# EAGLE design power board - LiPo (EAGLE 5.07)
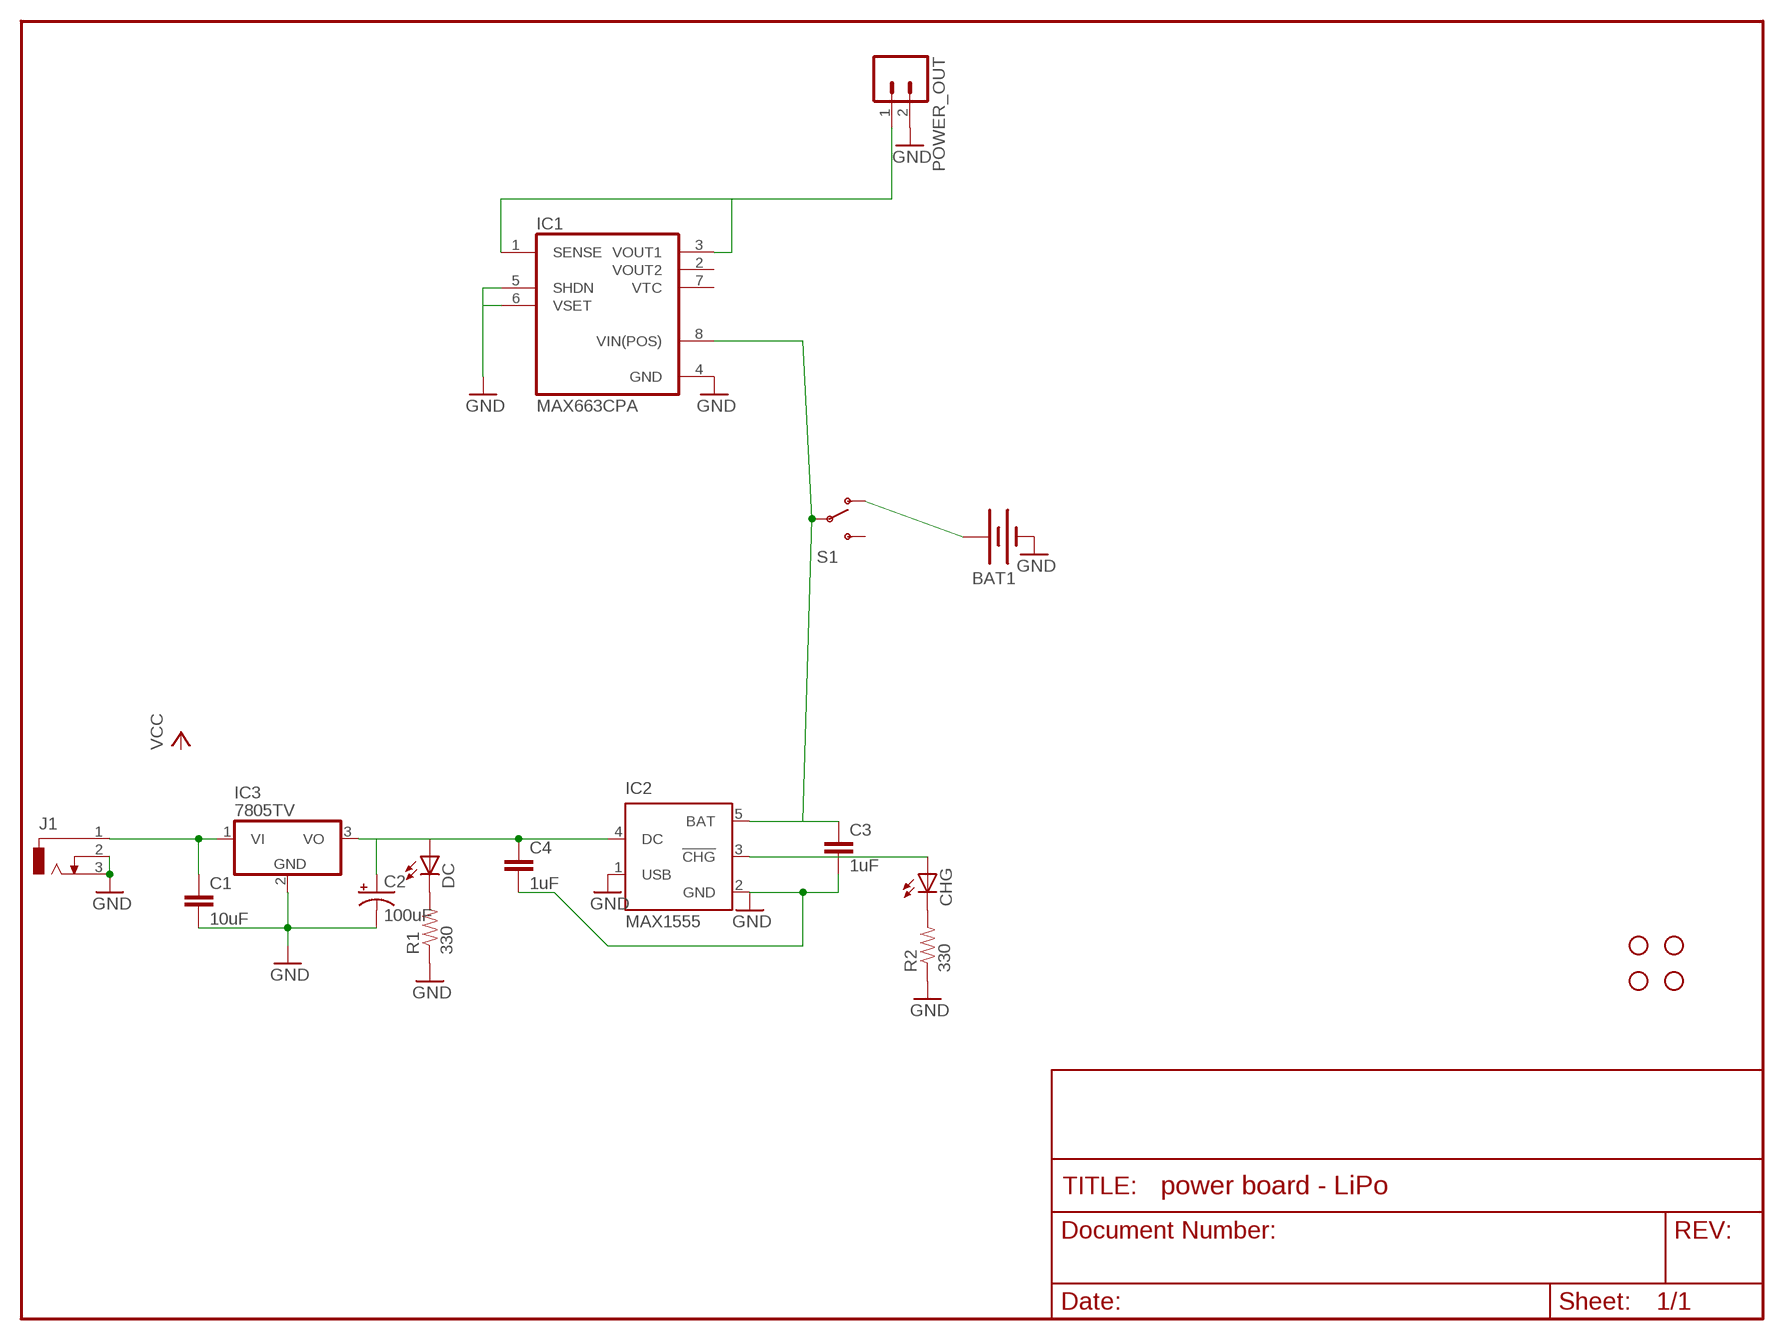
[diagram p0: schematic, sheet 1]

## Parts
BAT1  BATTERY1100  [LIPO-1100MAH]
C1  10uF  CAPPTH1  [CAP-PTH-5MM]
C2  100uF  CAP_POLPTH1  [CPOL-RADIAL-100UF-25V]
C3  1uF  CAPPTH1  [CAP-PTH-5MM]
C4  1uF  CAPPTH1  [CAP-PTH-5MM]
CHG  LED3MM  [LED3MM]
DC  LED3MM  [LED3MM]
IC1  MAX663CPA  [DIL08]
IC2  MAX1555  [SOT23-5L]
IC3  7805TV  [TO220V]
J1  DCJ0303  [DCJ0303]
JP1  STAND-OFFTIGHT  [STAND-OFF-TIGHT]
JP2  STAND-OFFTIGHT  [STAND-OFF-TIGHT]
JP3  STAND-OFFTIGHT  [STAND-OFF-TIGHT]
JP4  STAND-OFFTIGHT  [STAND-OFF-TIGHT]
POWER_OUT  M02LOCK  [1X02_LOCK]
R1  330  RESISTORPTH1  [AXIAL-0.3]
R2  330  RESISTORPTH1  [AXIAL-0.3]
S1  SWITCH-SPSTPTH_LOCK  [SWITCH-SPDT_LOCK.007S]

## Nets
GND: BAT1.- C1.2 C2.2(-) C3.2 C4.2 IC1.4(GND) IC1.5(SHDN) IC1.6(VSET) IC2.1(USB) IC2.2(GND) IC3.2(GND) J1.2 J1.3 POWER_OUT.2 R1.P$1 R2.P$1
N$1: BAT1.+ S1.1(O)
N$2: C1.1 IC3.1(VI) J1.1
N$3: IC1.1(SENSE) IC1.3(VOUT1) POWER_OUT.1
N$4: C2.1(+) C4.1 DC.A IC2.4(DC) IC3.3(VO)
N$5: C3.1 IC1.8(VIN(POS)) IC2.5(BAT) S1.2(P)
N$6: DC.K(C) R1.P$2
N$7: CHG.K(C) R2.P$2
N$8: CHG.A IC2.3(!CHG)
Unconnected: IC1.2(VOUT2) IC1.7(VTC) S1.3(S)

## Library data of the parts
BAT1 = SparkFun:BATTERY: Battery Holders Various common sizes : AA, AAA, 20mm coin cell and 12mm coin cell.
C1 C3 C4 = SparkFun:CAP: Capacitor Standard 0603 ceramic capacitor, and 0.1" leaded capacitor.
C2 = SparkFun:CAP_POL: Capacitor Polarized These are standard SMD and PTH capacitors. Normally 10uF, 47uF, and 100uF in electrolytic and tantalum varieties. Always verify the external diameter of the through hole cap, it varies with capacity, voltage, and manufacturer. The EIA devices should be standard.
CHG DC = led:LED: LED OSRAM: - CHIPLED LG R971, LG N971, LY N971, LG Q971, LY Q971, LO R971, LY R971 LH N974, LH R974 LS Q976, LO Q976, LY Q976 LO Q996 - Hyper CHIPLED LW Q18S LB Q993, LB Q99A, LB R99A - SideLED LS A670, LO A670, LY A670, LG A670, LP A670 LB A673, LV A673, LT A673, LW A673 LH A674 LY A675 LS A676, LA A676, LO A676, LY A676, LW A676 LS A679, LY A679, LG A679 - Hyper Micro SIDELED® LS Y876, LA Y876, LO Y876, LY Y876 LT Y87S - SmartLED LW L88C, LW L88S LB L89C, LB L89S, LG L890 LS L89K, LO L89K, LY L89K LS L896, LA L896, LO L896, LY L896 - TOPLED LS T670, LO T670, LY T670, LG T670, LP T670 LSG T670, LSP T670, LSY T670, LOP T670, LYG T670 LG T671, LOG T671, LSG T671 LB T673, LV T673, LT T673, LW T673 LH T674 LS T676, LA T676, LO T676, LY T676, LB T676, LH T676, LSB T676, LW T676 LB T67C, LV T67C, LT T67C, LS T67K, LO T67K, LY T67K, LW E67C LS E67B, LA E67B, LO E67B, LY E67B, LB E67C, LV E67C, LT E67C LW T67C LS T679, LY T679, LG T679 LS T770, LO T770, LY T770, LG T770, LP T770 LB T773, LV T773, LT T773, LW T773 LH T774 LS E675, LA E675, LY E675, LS T675 LS T776, LA T776, LO T776, LY T776, LB T776 LHGB T686 LT T68C, LB T68C - Hyper Mini TOPLED® LB M676 - Mini TOPLED Santana® LG M470 LS M47K, LO M47K, LY M47K Source: http://www.osram.convergy.de LUXEON: - LUMILED® LXK2-PW12-R00, LXK2-PW12-S00, LXK2-PW14-U00, LXK2-PW14-V00 LXK2-PM12-R00, LXK2-PM12-S00, LXK2-PM14-U00 LXK2-PE12-Q00, LXK2-PE12-R00, LXK2-PE12-S00, LXK2-PE14-T00, LXK2-PE14-U00 LXK2-PB12-K00, LXK2-PB12-L00, LXK2-PB12-M00, LXK2-PB14-N00, LXK2-PB14-P00, LXK2-PB14-Q00 LXK2-PR12-L00, LXK2-PR12-M00, LXK2-PR14-Q00, LXK2-PR14-R00 LXK2-PD12-Q00, LXK2-PD12-R00, LXK2-PD12-S00 LXK2-PH12-R00, LXK2-PH12-S00 LXK2-PL12-P00, LXK2-PL12-Q00, LXK2-PL12-R00 Source: www.luxeon.com KINGBRIGHT: KA-3528ASYC Source: www.kingbright.com
IC1 = maxim:MAX663CPA: Positive VOLTAGE REGULATOR
IC2 = maxim:MAX1555: Dual-Input USB/AC Adapter 1-Cell Li+ Battery Chargers Source: http://www.maxim-ic.com .. MAX1551-MAX1555.pdf
IC3 = linear:78*: Positive VOLTAGE REGULATOR Source: http://cache.national.com/ds/LM/LM78L05.pdf http://www.fairchildsemi.com/ds/LM/LM7805.pdf
J1 = con-jack:DCJ0303: DC POWER JACK Source: DCJ0303.pdf
JP1-JP4 = SparkFun:STAND-OFF: Stand Off This is the mechanical footprint for a #4 phillips button head screw. Use the keepout ring to avoid running the screw head into surrounding components. SKU : PRT-00447
POWER_OUT = SparkFun:M02: Header 2 Standard 2-pin 0.1" header. Use with straight break away headers (SKU : PRT-00116), right angle break away headers (PRT-00553), swiss pins (PRT-00743), machine pins (PRT-00117), and female headers (PRT-00115). Molex polarized connector foot print use with SKU : PRT-08233 with associated crimp pins and housings.
R1 R2 = SparkFun:RESISTOR: Resistor Basic schematic elements and footprints for 0603, 1206, and PTH 1/10th watt (small) resistors.
S1 = SparkFun:SWITCH-SPST: SPST Switch Simple slide switch. Spark Fun Electronics SKU : COM-00102

## Board
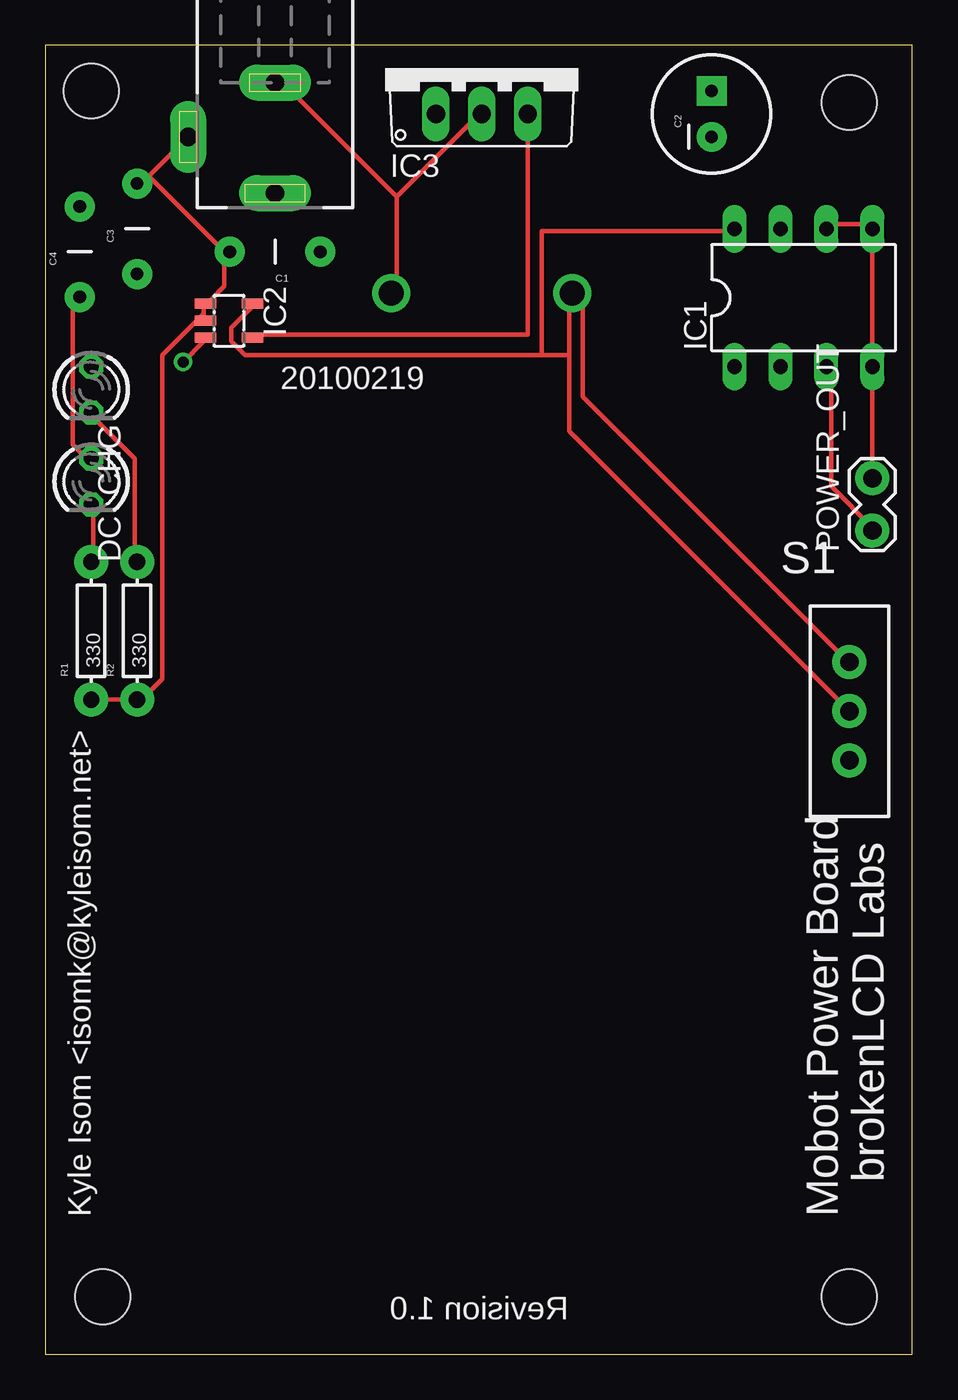
[diagram p1: board, top side]
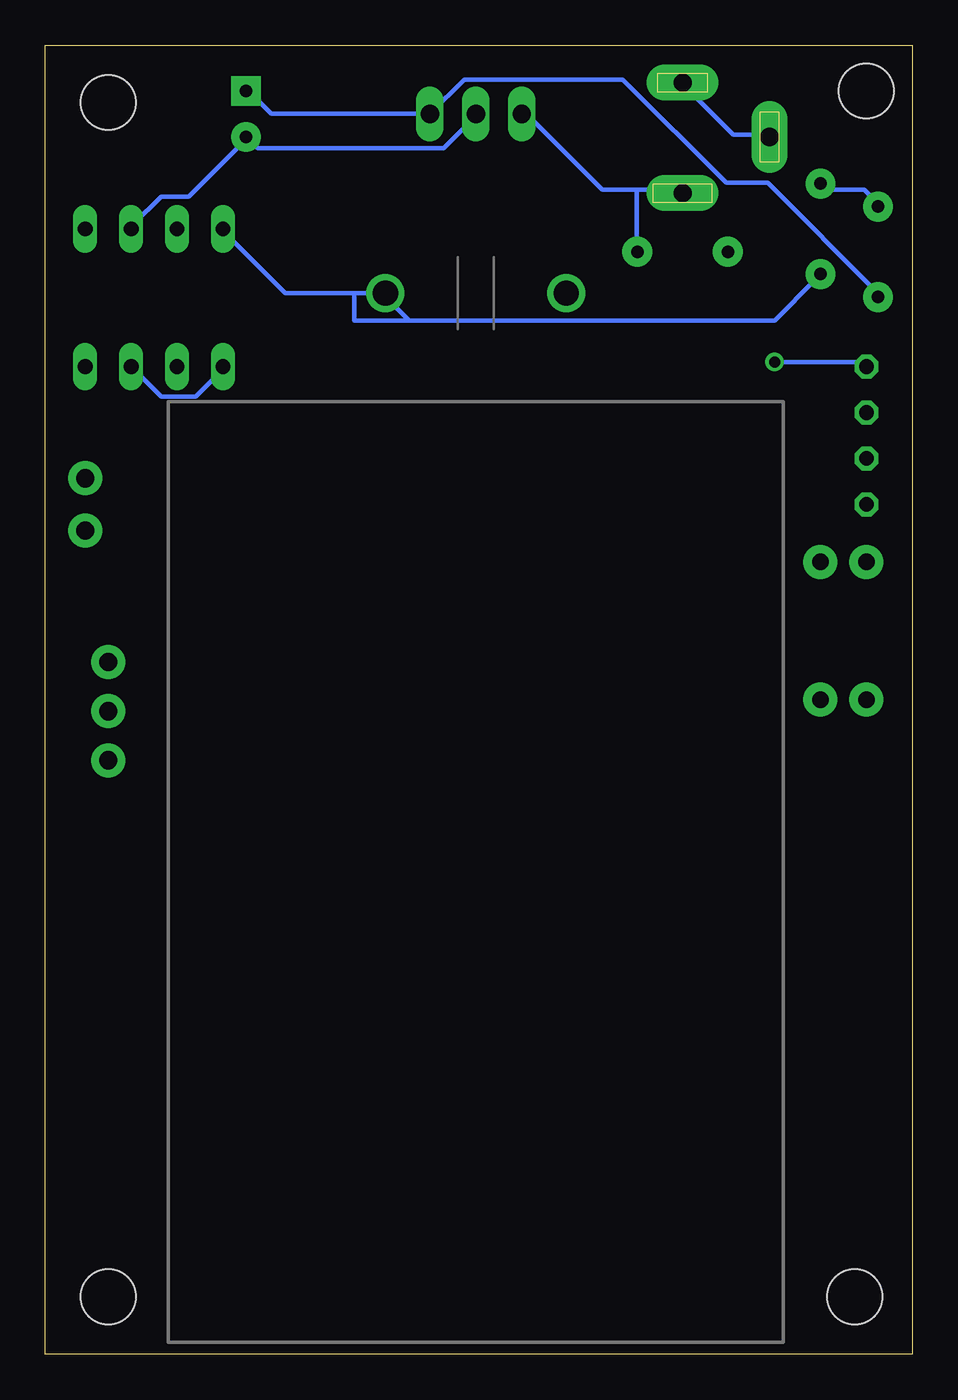
[diagram p2: board, bottom side, seen from below]

Size 47.93 x 72.38 mm. Coordinates in mm from the lower left corner, seen from the top.
Outline: 0,0 47.93,0 47.93,72.38 0,72.38 0,0
Copper layers (1*16): Top 0.035mm / dielectric 1.5mm / Bottom 0.035mm
Design rules "default": minimum track width 10mil, minimum drill 24mil, track to track 8mil, track to pad 8mil, pad to pad 8mil, via to via 8mil, smd to smd 8mil, copper to edge 40mil, drill to drill 8mil, minimum pad ring 10mil, minimum via ring 8mil, stop-mask expansion 4mil, vias tented up to drill 0mil, thermal gap 10mil

### Footprints (pad centres in the part's own frame; a part is rotated, then mirrored left to right if it is on the bottom)
LIPO-1100MAH = drill 1.397 round: + -5,32; - 5,32
CAP-PTH-5MM = drill 0.7 pad 1.651 round: 1 -2.5,0; 2 2.5,0
CPOL-RADIAL-100UF-25V = drill 0.7 pad 1.651 square: 1 1.27,0 | drill 0.7 pad 1.651 round: 2 -1.27,0
LED3MM = drill 0.813 octagon: A -1.27,0; K 1.27,0
DIL08 = drill 0.813 long: 1 -3.81,-3.81; 2 -1.27,-3.81; 3 1.27,-3.81; 4 3.81,-3.81; 5 3.81,3.81; 6 1.27,3.81; 7 -1.27,3.81; 8 -3.81,3.81
SOT23-5L = smd 0.55 x 1.2: 1 -0.95,-1.3; 2 0,-1.3; 3 0.95,-1.3; 4 0.95,1.3; 5 -0.95,1.3
TO220V = drill 1.016 long: 1 -2.54,-2.54; 2 0,-2.54; 3 2.54,-2.54
DCJ0303 = drill 1 pad 2 long: 1 0,3.1; 2 4.8,0; 3 0,-3
STAND-OFF-TIGHT = hole 3.048: 0,0
1X02_LOCK = drill 1.016 pad 1.88 round: 1 -0.178,0; 2 2.718,0
AXIAL-0.3 = drill 0.9 pad 1.88 round: P$1 -3.81,0; P$2 3.81,0
SWITCH-SPDT_LOCK.007S = drill 1.016 pad 1.88 round: 1 0,2.718; 2 0,0; 3 0,-2.718

### Placement (x,y rotation side)
BAT1  24.13,26.67 0 bottom
C1  12.7,60.96 180 top
C2  36.83,68.58 90 top
C3  5.08,62.23 90 top
C4  1.91,60.96 90 top
CHG  2.54,53.34 270 top
DC  2.54,48.26 270 top
IC1  41.91,58.42 0 top
IC2  10.16,57.15 270 top
IC3  24.13,71.12 0 top
J1  12.7,67.31 180 top
JP1  2.54,69.85 0 top
JP2  3.17,3.17 0 top
JP3  44.45,69.22 0 top
JP4  44.45,3.17 0 top
POWER_OUT  45.72,45.72 90 top
R1  2.54,40.01 90 top
R2  5.08,40.01 90 top
S1  44.45,35.56 0 top

### Tracks (layer width: path | path; a pad name or v marks a point on that pad's centre or on a via)
GND
  Top 0.254: POWER_OUT.2 IC1.4 IC1.5 45.72,62.48 43.43,62.48 IC1.6 | 19.43,64.01 24,68.58 IC3.2 | 19.43,64.01 19.43,58.67 BAT1.- | R1.P$1 R2.P$1 5.33,36.2 6.48,37.34 6.48,55.24 8.76,57.53 | 8.76,57.53 8.76,57.91 IC2.1 9.14,58.29 9.91,59.05 9.91,60.96 | 8.76,57.53 8.76,57.15 IC2.2 | 5.71,65.15 5.33,64.77 C3.2 5.71,65.15 | 5.71,65.15 7.62,67.06 J1.2 | 9.91,60.96 5.71,65.15 | 9.91,60.96 C1.2 | 19.43,64.01 12.95,70.48 J1.3
  Bottom 0.254: IC1.6 43.05,62.48 41.53,64.01 40.01,64.01 36.96,67.06 C2.2 36.2,66.67 25.91,66.67 24,68.58 IC3.2 | C4.2 1.91,63.63 2.67,64.39 4.95,64.39 C3.2 | J1.3 12.57,70.1 9.91,67.44 8,67.44 J1.2
N$1
  Top 0.254: S1.1 44.2,38.48 29.72,52.96 29.72,58.29 29.34,58.67 BAT1.+
N$2
  Bottom 0.254: 15.24,64.39 12.95,64.39 J1.1 | 15.24,64.39 17.14,64.39 21.34,68.58 IC3.1 | 15.24,64.39 15.24,60.96 C1.1
N$3
  Top 0.254: POWER_OUT.1 45.72,45.72 43.43,48.01 43.43,54.48 IC1.3
  Bottom 0.254: IC1.1 38.1,54.48 39.62,52.96 41.53,52.96 IC1.3
N$4
  Top 0.254: DC.A 2.29,49.53 1.52,50.29 1.52,57.91 1.91,58.29 C4.1 | IC3.3 26.67,56.39 11.81,56.39 IC2.4
  Bottom 0.254: C2.1 36.58,69.72 35.43,68.58 IC3.3 24.77,70.48 16,70.48 10.29,64.77 8,64.77 1.91,58.67 C4.1
N$5
  Top 0.254: 27.43,55.24 11.05,55.24 10.29,56.01 10.29,56.77 11.43,57.91 IC2.5 | 27.43,55.24 28.96,55.24 | 28.96,55.24 28.96,58.29 | 28.96,55.24 28.96,51.05 S1.2 | 27.43,55.24 27.43,62.1 38.1,62.1 IC1.8
  Bottom 0.254: 30.86,58.67 29.34,58.67 | 30.86,58.67 34.67,58.67 38.1,62.1 IC1.8 | 27.81,57.15 7.62,57.15 5.33,59.44 C3.1 | 27.81,57.15 28.96,58.29 | 30.86,58.67 30.86,57.15 27.81,57.15
N$6
  Top 0.254: DC.K 2.67,46.86 2.67,43.81 R1.P$2
N$7
  Top 0.254: CHG.K 2.67,51.82 4.95,49.53 4.95,43.81 R2.P$2
N$8  (via drill 0.61)
  Top 0.254: v7.62,54.86 8.76,56.01 IC2.3
  Bottom 0.254: v7.62,54.86 2.67,54.86 CHG.A

### Text on the board
tPlace: 20100219 | brokenLCD Labs | Kyle Isom <isomk@kyleisom.net> | Mobot Power Board | Revision 1.0